# EAGLE schematic gainster2 (EAGLE 7.5.0)
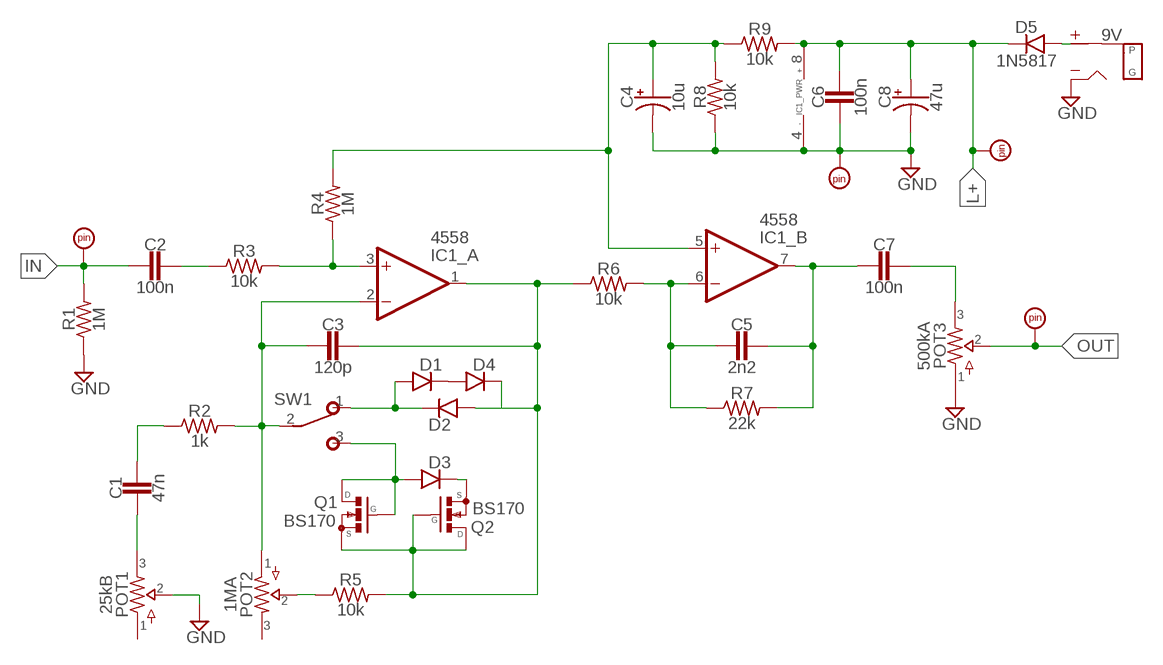
[diagram p0: schematic, sheet 1]

## Parts
9V  DC_MONO  [DC]
C1  47n  CER/FILM2  [050X030_025_2]
C2  100n  CER/FILM2  [050X030_025_2]
C3  120p  CER/FILM2  [050X030_025_2]
C4  10u  0501  [050_020_1]
C5  2n2  CER/FILM2  [050X030_025_2]
C6  100n  CER/FILM2  [050X030_025_2]
C7  100n  CER/FILM2  [050X030_025_2]
C8  47u  0501  [050_020_1]
D1  DO41.2  [DO41-2]
D2  DO41.2  [DO41-2]
D3  DO41.2  [DO41-2]
D4  DO41.2  [DO41-2]
D5  1N5817  DO35.3  [DO35-3]
IC1  4558  DUALTH  [DIL08]
IN  PADSQR  [SQUARE]
LED  PADSQR  [SQUARE]
OUT  PADSQR  [SQUARE]
PAD2  PADRND  [ROUND]
POT1  25kB  POTS16MM  [16MM]
POT2  1MA  POTS16MM  [16MM]
POT3  500kA  POTS16MM  [16MM]
Q1  BS170  [SOT54ES]
Q2  BS170  [SOT54ES]
R1  1M  R_.3B  [R0207/3]
R2  1k  R_.3B  [R0207/3]
R3  10k  R_.3B  [R0207/3]
R4  1M  R_.3B  [R0207/3]
R5  10k  R_.3B  [R0207/3]
R6  10k  R_.3B  [R0207/3]
R7  22k  R_.3B  [R0207/3]
R8  10k  R_.3B  [R0207/3]
R9  10k  R_.3B  [R0207/3]
SW1  SPDT  [M9040P]

## Nets
GND: 9V.S(SLEEVE) C4.- C6.2 C8.- IC1.4(_PWR:V-) PAD2.1 POT1.2 POT3.1 R1.1 R8.1
IN: C2.2 IN.1 R1.2
L+: C6.1 C8.+ D5.C IC1.8(_PWR:V+) LED.1 R9.2
N$1: C3.1 D2.A D4.C IC1.1(_A:OUT) Q1.S Q2.D Q2.G R5.2 R6.1
N$2: C2.1 R3.1
N$3: IC1.3(_A:+IN) R3.2 R4.1
N$4: 9V.T(TIP) D5.A
N$6: C4.+ IC1.5(_B:+IN) R4.2 R8.2 R9.1
N$7: D3.C Q2.S
N$8: C5.1 C7.2 IC1.7(_B:OUT) R7.2
N$9: C7.1 POT3.3
N$12: C5.2 IC1.6(_B:-IN) R6.2 R7.1
N$13: POT2.2 R5.1
N$14: C3.2 IC1.2(_A:-IN) POT2.1 R2.2 SW1.2(P)
N$15: C1.1 R2.1
N$16: C1.2 POT1.3
N$17: D1.A D2.C SW1.1(O)
N$18: D1.C D4.A
N$19: D3.A Q1.D Q1.G SW1.3(S)
OUT: OUT.1 POT3.2
Unconnected: POT1.1 POT2.3

## Library data of the parts
9V = jacks:DC_MONO
C1-C3 C5-C7 = capacitors-film:CER/FILM: 47 - 120pF Xicon Ceramic Disc 2.5mm lead spacing
C4 C8 = capacitors-elec:050: 0.22 - 100uF Xicon values at Mouser.com: 10V: 10 - 100uF; 16V: 2.2 - 47uF; 25V: 0.47 - 47uF; 50V: 0.22 - 22uF
D1-D4 = diodes:DO41: DO-41 Package Diodes: 1N4001 - 1N40019 Zener Diodes: 1N4728 - 1N4764
D5 = diodes:DO35: DO-35 Package Diodes: 1N914
IC1 = integrated circuits:DUAL: OP AMP
IN LED OUT PAD2 = supply pins:PAD
POT1-POT3 = potentiometers:POTS
Q1 Q2 = transistors:BS170: N-CHANNEL MOS FET
R1-R9 = resistors:R_
SW1 = switches:SPDT: TOGGLE SWITCH Marquardt